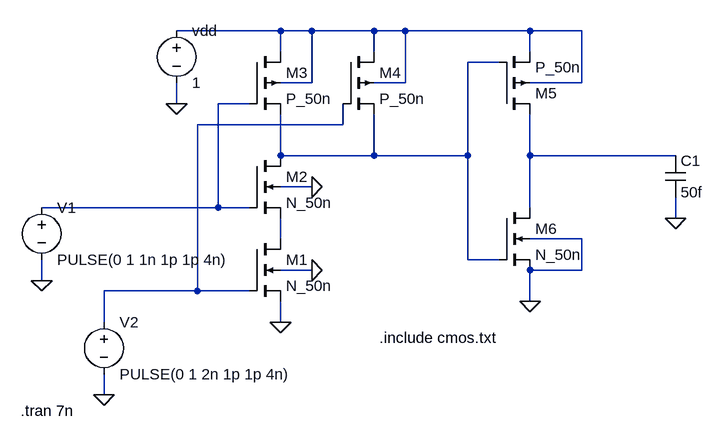
[diagram p0: schematic and.asc]
and.asc, the LTspice schematic file:
Version 4
SHEET 1 880 680
WIRE 208 -96 48 -96
WIRE 256 -96 208 -96
WIRE 352 -96 256 -96
WIRE 400 -96 352 -96
WIRE 592 -96 400 -96
WIRE 672 -96 592 -96
WIRE 208 -64 208 -96
WIRE 352 -64 352 -96
WIRE 592 -64 592 -96
WIRE 544 -48 496 -48
WIRE 256 -16 256 -96
WIRE 256 -16 208 -16
WIRE 400 -16 400 -96
WIRE 400 -16 352 -16
WIRE 672 -16 672 -96
WIRE 672 -16 592 -16
WIRE 48 16 48 -16
WIRE 160 16 112 16
WIRE 304 48 304 16
WIRE 304 48 80 48
WIRE 208 96 208 32
WIRE 352 96 352 32
WIRE 352 96 208 96
WIRE 496 96 496 -48
WIRE 496 96 352 96
WIRE 592 96 592 32
WIRE 816 96 592 96
WIRE 256 144 208 144
WIRE 112 176 112 16
WIRE 112 176 -160 176
WIRE 160 176 112 176
WIRE 592 176 592 96
WIRE 816 192 816 160
WIRE 208 224 208 192
WIRE 672 224 592 224
WIRE 496 256 496 96
WIRE 544 256 496 256
WIRE 256 272 208 272
WIRE 672 272 672 224
WIRE 672 272 592 272
WIRE -160 288 -160 256
WIRE 80 304 80 48
WIRE 80 304 -64 304
WIRE 160 304 80 304
WIRE 592 320 592 272
WIRE -64 352 -64 304
WIRE 208 352 208 320
WIRE -64 464 -64 432
FLAG 256 144 0
FLAG 256 272 0
FLAG 208 352 0
FLAG 48 16 0
FLAG 592 320 0
FLAG -160 288 0
FLAG -64 464 0
FLAG 816 192 0
SYMBOL nmos4 160 224 R0
SYMATTR InstName M1
SYMATTR Value2 l=50n w=500n
SYMATTR Value N_50n
SYMBOL nmos4 160 96 R0
SYMATTR InstName M2
SYMATTR Value2 l=50n w=500n
SYMATTR Value N_50n
SYMBOL pmos4 160 -64 R0
SYMATTR InstName M3
SYMATTR Value2 l=50n w=1u
SYMATTR Value P_50n
SYMBOL pmos4 304 -64 R0
SYMATTR InstName M4
SYMATTR Value2 l=50n w=1u
SYMATTR Value P_50n
SYMBOL voltage 48 -112 R0
WINDOW 123 0 0 Left 0
WINDOW 39 0 0 Left 0
SYMATTR InstName vdd
SYMATTR Value 1
SYMBOL nmos4 544 176 R0
SYMATTR InstName M6
SYMATTR Value N_50n
SYMATTR Value2 l=50n w=500n
SYMBOL pmos4 544 32 M180
SYMATTR InstName M5
SYMATTR Value P_50n
SYMATTR Value2 l=50n w=1u
SYMBOL cap 800 96 R0
SYMATTR InstName C1
SYMATTR Value 50f
SYMBOL voltage -160 160 R0
SYMATTR InstName V1
SYMATTR Value PULSE(0 1 1n 1p 1p 4n)
SYMBOL voltage -64 336 R0
SYMATTR InstName V2
SYMATTR Value PULSE(0 1 2n 1p 1p 4n)
TEXT 360 376 Left 2 !.include cmos.txt
TEXT -192 488 Left 2 !.tran 7n

The netlist it stands for:
* and.asc
M1 N006 N004 0 0 N_50n l=50n w=500n
M2 N002 N003 N006 0 N_50n l=50n w=500n
M3 N001 N003 N002 N001 P_50n l=50n w=1u
M4 N001 N004 N002 N001 P_50n l=50n w=1u
vdd N001 0 1
M6 N005 N002 0 0 N_50n l=50n w=500n
M5 N005 N002 N001 N001 P_50n l=50n w=1u
C1 N005 0 50f
V1 N003 0 PULSE(0 1 1n 1p 1p 4n)
V2 N004 0 PULSE(0 1 2n 1p 1p 4n)
.model NMOS NMOS
.model PMOS PMOS
.lib standard.mos
.include cmos.txt
.tran 7n
.backanno
.end